# EAGLE design ap5724,6-boost-driver-mk-1.0 (EAGLE 7.5.0)
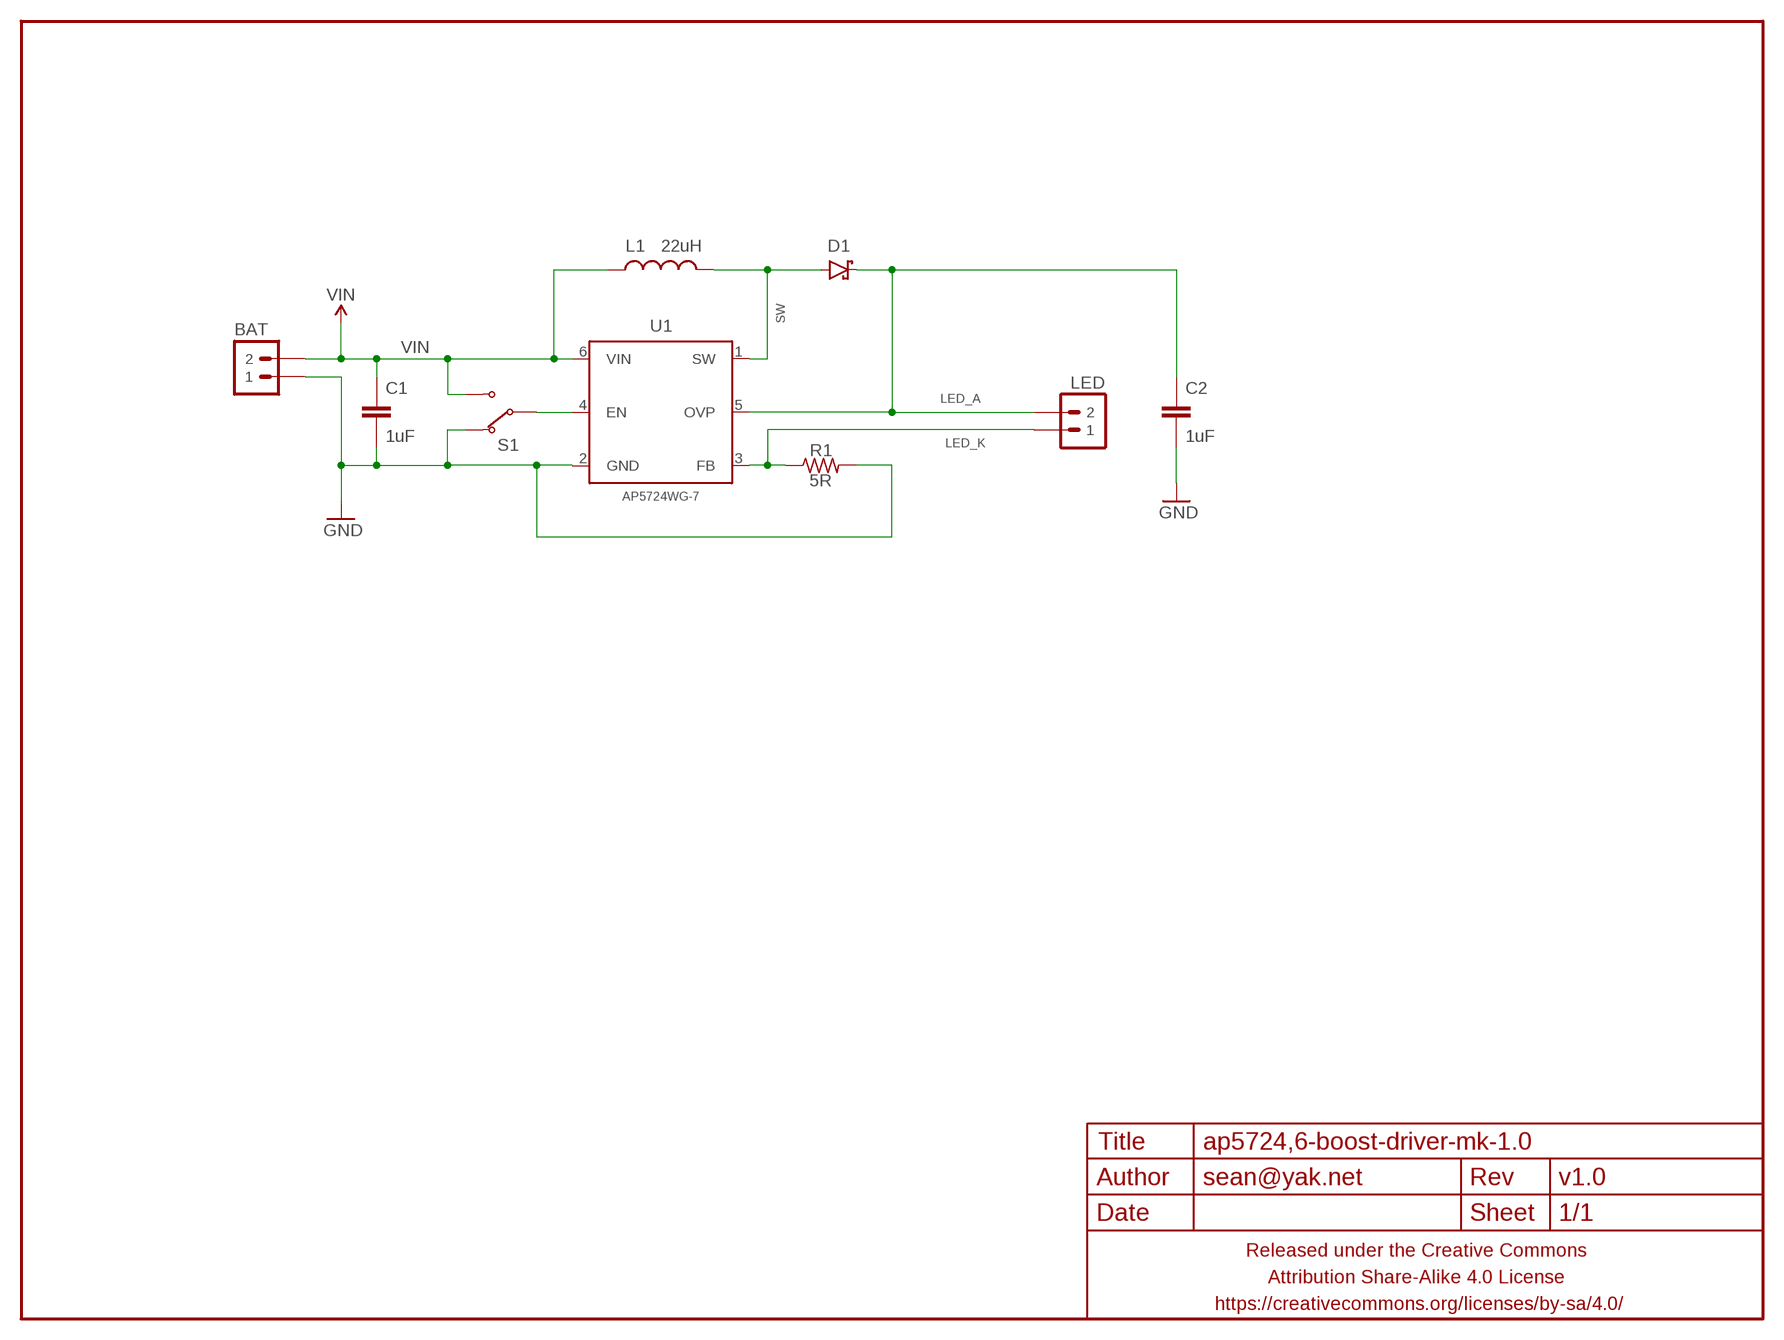
[diagram p0: schematic, sheet 1]

## Parts
BAT  M02PTH-CENTERED  [1X02-CENTER]
C1  1uF  CAPACITOR-CERAMICC0603-TIGHTER  [C0603-TIGHTER]
C2  1uF  CAPACITOR-CERAMICC0603-TIGHTER  [C0603-TIGHTER]
D1  DIODE-SCHOTTKYSOD323  [SOD323-SCHOTTKY]
FRAME1  FRAME-LETTERNO_PACKAGE  [DUMMY]
L1  22uH  INDUCTOR0603-TIGHTER  [L0603]
LED  M02PTH-CENTERED  [1X02-CENTER]
R1  5R  RESISTORR0603-TIGHTER  [R0603-TIGHTER]
S1  SWITCH-SPDTJS102011SAQN  [SWITCH-SPDT-SMD-RA-JS102011SAQN]
U1  AP5724WG-7  AP5724,6SOT26  [SOT26]

## Nets
GND: BAT.1 C1.2 C2.2 R1.2 S1.3(NC) U1.2(GND)
LED_A: C2.1 D1.C LED.2 U1.5(OVP)
LED_K: LED.1 R1.1 U1.3(FB)
N$2: S1.2(COM) U1.4(EN)
SW: D1.A L1.2 U1.1(SW)
VIN: BAT.2 C1.1 L1.1 S1.1(NO) U1.6(VIN)

## Library data of the parts
BAT LED = a_parts:M02: Standard 2-pin 0.1" header. Use with - straight break away headers ( PRT-00116) - right angle break away headers (PRT-00553) - swiss pins (PRT-00743) - machine pins (PRT-00117) - female headers (PRT-00115) Molex polarized connector foot print use with: PRT-08233 with associated crimp pins and housings. 2.54_SCREWTERM for use with PRT-10571. 3.5mm Screw Terminal footprints for PRT-08084 5mm Screw Terminal footprints for use with PRT-08433
C1 C2 = a_parts:CAPACITOR-CERAMIC: CAPACITOR, European symbol
D1 = a_parts:DIODE-SCHOTTKY: Schottky diodes in SFE's production catalog BAT20J 1A 23V 0.62Vf RB751 120mA 40V 0.37Vf PMEG4005EJ 0.5A 40V 0.42Vf MBRA140 1A 40V 0.5Vf B340A 3A 40V SMA
FRAME1 = a_parts:FRAME-LETTER: Schematic Frame Standard 8.5x11 US Letter frame; DESIGNER: sean@yak.net; VERSION: v1.0
L1 = a_parts:INDUCTOR: Inductors Basic Inductor/Choke - 0603 and 1206. Footprints are not proven and vary greatly between part numbers. SRN6045- 33uH, 20% 1.4A SDR0403-560KL - 56uH, 10%, 500mA RMS/740mA peak
R1 = a_parts:RESISTOR: RESISTOR, American symbol
S1 = a_parts:SWITCH-SPDT
U1 = a_parts:AP5724,6

## Board
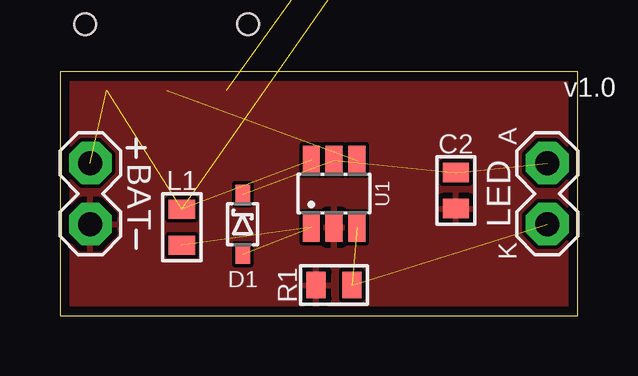
[diagram p1: board, top side]
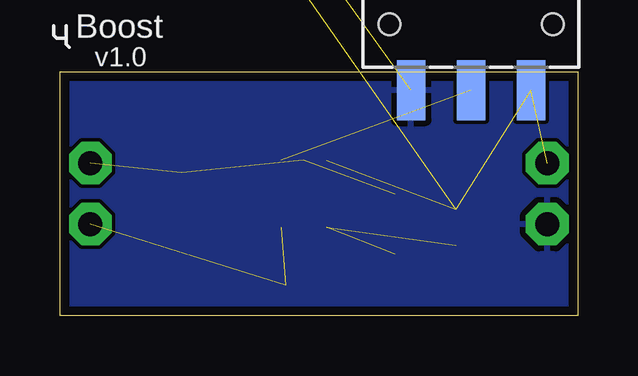
[diagram p2: board, bottom side, seen from below]

Size 21.59 x 10.16 mm. Coordinates in mm from the lower left corner, seen from the top.
Outline: 21.59,0 21.59,10.16 0,10.16 0,0 21.59,0
Copper layers (1*16): Top 0.0356mm / dielectric 1.5011mm / Bottom 0.0356mm
Design rules "LaenPCBOrder2": minimum track width 6mil, minimum drill 13mil, track to track 6mil, track to pad 6mil, pad to pad 6mil, via to via 6mil, smd to smd 6mil, copper to edge 15mil, drill to drill 6mil, minimum pad ring 7mil, minimum via ring 7mil, stop-mask expansion 3mil, vias tented up to drill 20mil, thermal gap 10mil

### Footprints (pad centres in the part's own frame; a part is rotated, then mirrored left to right if it is on the bottom)
1X02-CENTER = drill 1 pad 1.778 octagon: 1 -1.27,0; 2 1.27,0
C0603-TIGHTER = smd 0.8 x 1.1: 1 -0.75,0; 2 0.75,0
SOD323-SCHOTTKY = smd 0.8 x 0.6: A -1.25,0; C 1.25,0
L0603 = smd 0.8 x 1.1: 1 -0.75,0; 2 0.75,0
R0603-TIGHTER = smd 0.8 x 1.1: 1 -0.75,0; 2 0.75,0
SWITCH-SPDT-SMD-RA-JS102011SAQN = smd 1.2 x 2.5: 1 -2.5,0; 2 0,0; 3 2.5,0 | hole 0.9: -3.4,-2.75; 3.4,-2.75
SOT26 = smd 0.7 x 1.2: 1 -0.95,-1.4; 2 0,-1.4; 3 0.95,-1.4; 4 0.95,1.4; 5 0,1.4; 6 -0.95,1.4

### Placement (x,y rotation side)
BAT  1.27,5.08 90 top
C1  11.43,14.61 180 top  (outside the outline)
C2  16.51,5.21 270 top
D1  7.62,3.81 90 top
FRAME1  0,0 0 top
L1  5.08,3.68 270 top
LED  20.32,5.08 90 top
R1  11.43,1.27 180 top
S1  4.45,9.4 180 bottom
U1  11.43,5.08 0 top

### Tracks (layer width: path | path; a pad name or v marks a point on that pad's centre or on a via)
GND  (1 unrouted)
  pour Bottom (isolate 0.152, rank 6): 0,10.16 21.59,10.16 21.59,0 0,0
  pour Top (isolate 0.152, rank 6): 0,10.16 21.59,10.16 21.59,0 0,0
LED_A  (3 unrouted)
LED_K  (2 unrouted)
N$2  (1 unrouted)
SW  (2 unrouted)
VIN  (4 unrouted)

### Text on the board
tPlace: A | K
bPlace: Boost | LED / Driver